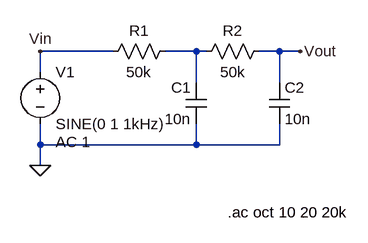
[diagram p0: schematic crossover2.asc]
crossover2.asc, the LTspice schematic file:
Version 4
SHEET 1 880 680
WIRE -128 32 -240 32
WIRE 0 32 -48 32
WIRE 16 32 0 32
WIRE 128 32 96 32
WIRE 160 32 128 32
WIRE -240 64 -240 32
WIRE 0 80 0 32
WIRE 128 80 128 32
WIRE -240 176 -240 144
WIRE 0 176 0 144
WIRE 0 176 -240 176
WIRE 128 176 128 144
WIRE 128 176 0 176
WIRE -240 208 -240 176
FLAG -240 208 0
FLAG -240 32 Vin
FLAG 160 32 Vout
SYMBOL res -32 16 R90
WINDOW 0 0 56 VBottom 2
WINDOW 3 32 56 VTop 2
SYMATTR InstName R1
SYMATTR Value 50k
SYMBOL cap 16 144 R180
WINDOW 0 24 56 Left 2
WINDOW 3 24 8 Left 2
SYMATTR InstName C1
SYMATTR Value 10n
SYMBOL voltage -240 48 R0
WINDOW 123 24 124 Left 2
WINDOW 39 0 0 Left 2
SYMATTR InstName V1
SYMATTR Value SINE(0 1 1kHz)
SYMATTR Value2 AC 1
SYMBOL res 112 16 R90
WINDOW 0 0 56 VBottom 2
WINDOW 3 32 56 VTop 2
SYMATTR InstName R2
SYMATTR Value 50k
SYMBOL cap 112 80 R0
SYMATTR InstName C2
SYMATTR Value 10n
TEXT 48 280 Left 2 !.ac oct 10 20 20k

The netlist it stands for:
* crossover2.asc
R1 N001 Vin 50k
C1 0 N001 10n
V1 Vin 0 SINE(0 1 1kHz) AC 1
R2 Vout N001 50k
C2 Vout 0 10n
.ac oct 10 20 20k
.backanno
.end